# EAGLE design pwr_pos_lm317 (EAGLE 7.5.0)
Rusia Neagra MKII
TITLE: Rusia Neagra MKII

## Sheet 1 of 2: Rusia Neagra MKII power pcb
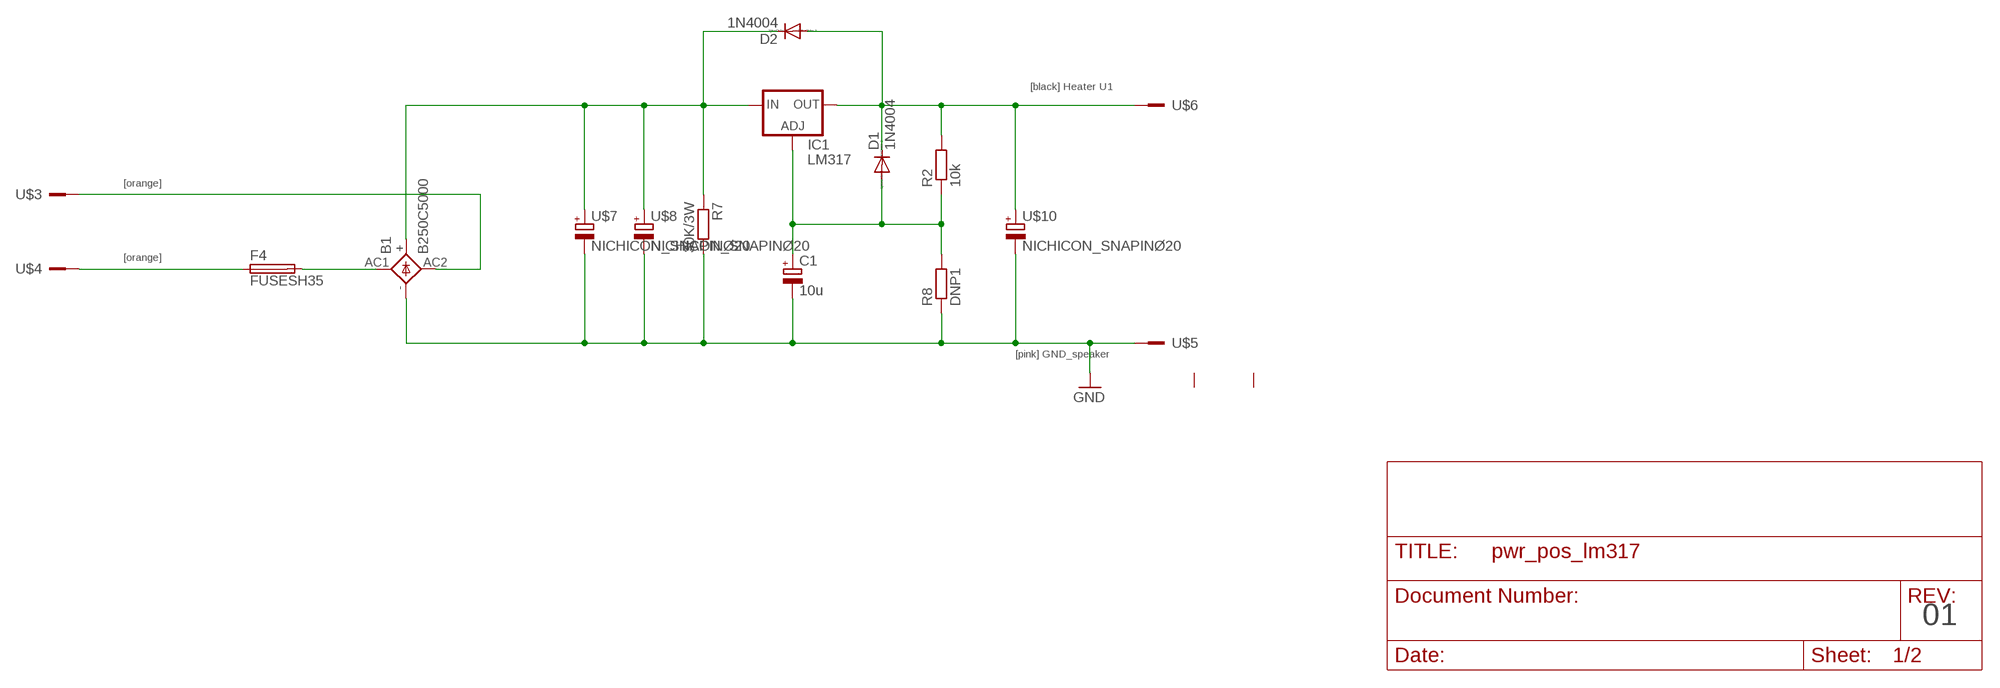
[diagram p0: schematic, sheet 1]

### Parts
B1  B250C5000  DIOTEC_BC5000  [DIOTEC_BC5000]
C1  10u  CPOL-EUE2,5-6E  [E2,5-6E]
D1  1N4004  [DO41-10]
D2  1N4004  [DO41-10]
F4  FUSESH35  [SH25]
IC1  LM317  LM317TS  [317TS]
R2  10k  R-EU_0411/12  [0411/12]
R7  30K/3W  R-EU_0922V  [0922V]
R8  DNP1  R-EU_0411/12  [0411/12]
U$1  SK456-60-3XM3L  [SK456-60-3XM3L]
U$2  RN_POWER  [RN]
U$3  M1  [M1_OFFSET]
U$4  M1  [M1_OFFSET]
U$5  M1  [M1_OFFSET]
U$6  M1  [M1_OFFSET]
U$7  NICHICON_SNAPINØ20  [C_20G10]
U$8  NICHICON_SNAPINØ20  [C_20G10]
U$10  NICHICON_SNAPINØ20  [C_20G10]

### Nets
30VAC_1: B1.AC2 U$3.1(KL)
30VAC_2: F4.1 U$4.1(KL)
GND: B1.- C1.- R7.2 R8.1 U$5.1(KL) U$7.- U$8.- U$10.-
N$2: B1.AC1 F4.2
N$3: C1.+ D1.A IC1.1(ADJ) R2.1 R8.2
N_C: B1.+ D2.C IC1.3(IN) R7.1 U$7.+ U$8.+
V+: D1.C D2.A IC1.2(OUT) R2.2 U$6.1(KL) U$10.+
Unconnected: U$1.P$1 U$1.P$2 U$2.SH@1 U$2.SH@2 U$2.SH@3 U$2.SH@4

### Notes on the sheet
- [black] Heater U1
- [orange]
- [orange]
- [pink] GND_speaker
- 01

## Sheet 2 of 2: Rusia Neagra MKII main point to point

## Library data of the parts
B1 = Simplex-DiscreteSemi:DIOTEC_BC5000: DIOTEC RECTIFIER B..C5000-3000A, B..C5000-3300A grid 1 x 10, 2 x 7,5 mm
C1 = rcl:CPOL-EU: POLARIZED CAPACITOR, European symbol
D1 D2 = diode:1N4004: DIODE general purpose rectifier, 1 A
F4 = fuse:FUSE: Fuse; OC_FARNELL: unknown; OC_NEWARK: unknown
IC1 = v-reg:LM317TS: VOLTAGE REGULATOR
R2 R7 R8 = rcl:R-EU_: RESISTOR, European symbol
U$1 = Simplex-Heatsinks:SK456-60-3XM3L: Fischer Elektronik SK456-60-3XM3L 2 pin heatsink 60x40, 40mm grid
U$2 = Simplex-Enclosures:RN_POWER: Rusia Neagra Amp power pcb
U$3-U$6 = Simplex-Connectors:M1: 1pin
U$7 U$8 U$10 = Simplex-rlc:NICHICON_SNAPIN: Nichicon snap-in capacitors

## Net classes
1 vcc: width 0.203 mm

## Board
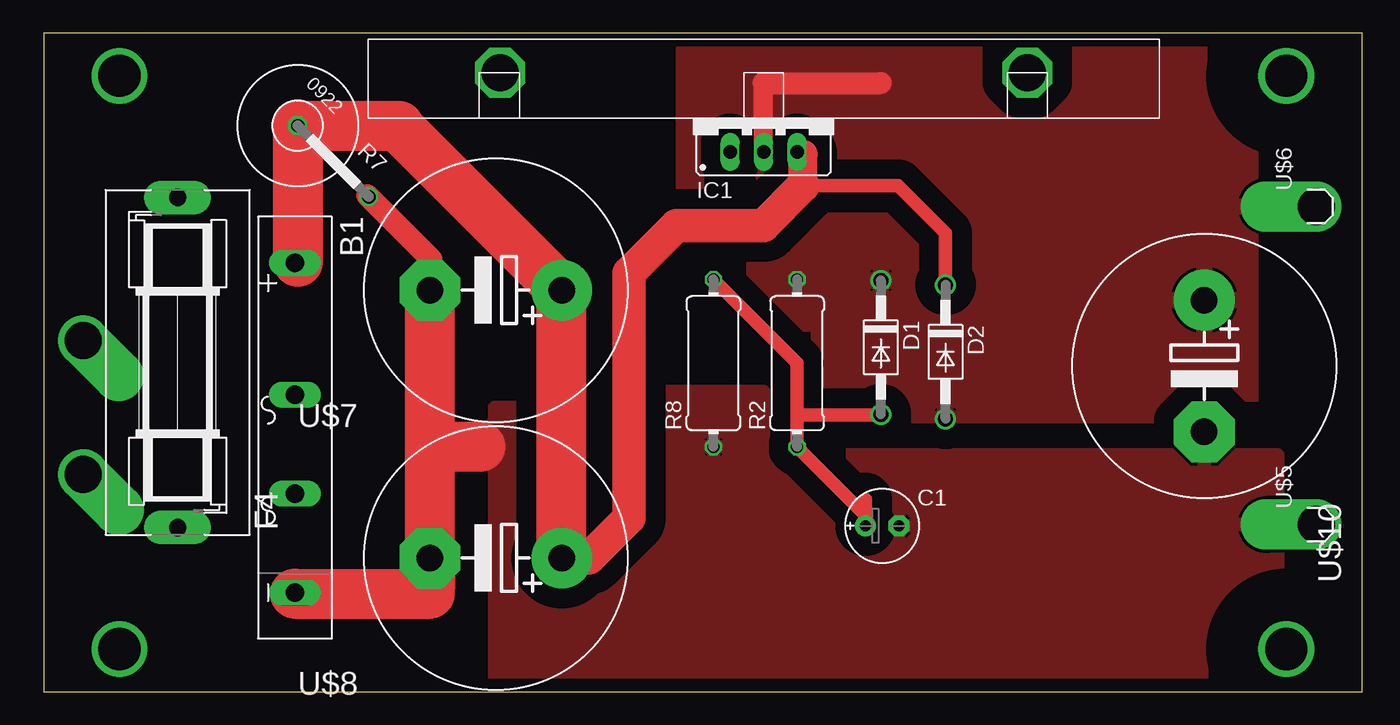
[diagram p1: board, top side]
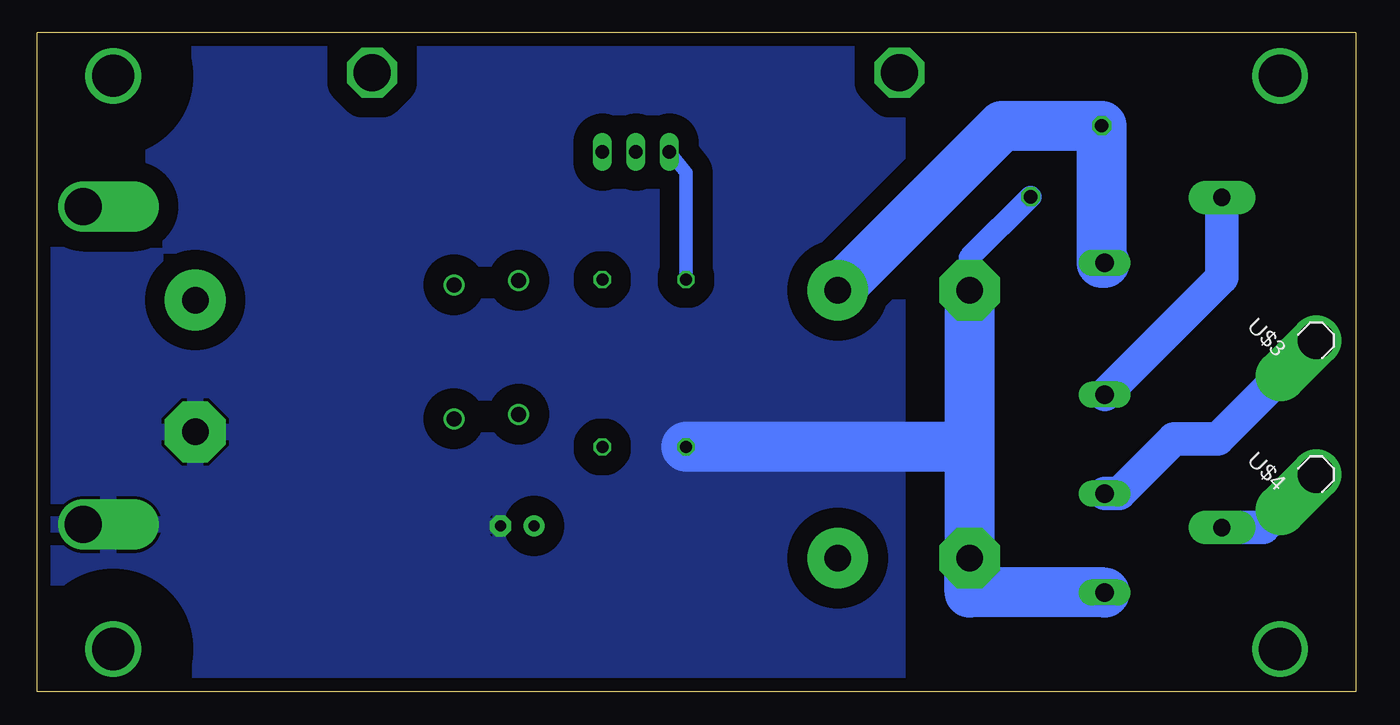
[diagram p2: board, bottom side, seen from below]

Size 100 x 50 mm. Coordinates in mm from the lower left corner, seen from the top.
Copper layers (1*16): Top 0.035mm / dielectric 1.5mm / Bottom 0.035mm
Design rules "default *": minimum track width 10mil, minimum drill 0.6mm, track to track 1.5mm, track to pad 1.5mm, pad to pad 1.5mm, via to via 1mm, smd to smd 1mm, copper to edge 40mil, drill to drill 8mil, minimum pad ring 0.2mm, minimum via ring 8mil, stop-mask expansion 4mil, vias tented up to drill 0mil, thermal gap 10mil

### Footprints (pad centres in the part's own frame; a part is rotated, then mirrored left to right if it is on the bottom)
DIOTEC_BC5000 = drill 1.397 long: + -13.5,0; - 11.5,0; AC1 -3.5,0; AC2 4,0
E2,5-6E = drill 0.813 pad 1.575: + -1.27,0 | drill 0.813 pad 1.575 octagon: - 1.27,0
DO41-10 = drill 1.118: A 5.08,0; C -5.08,0
SH25 = drill 1.321 pad 2.54 long: 1 -12.522,0; 2 12.522,0
317TS = drill 1.016 long: 1 -2.54,-2.54; 2 0,-2.54; 3 2.54,-2.54
0411/12 = drill 0.914 octagon: 1 -6.35,0; 2 6.35,0
0922V = drill 1.016 octagon: 1 -5.08,0; 2 2.54,0
SK456-60-3XM3L = drill 2.8 octagon: P$1 -20,0; P$2 20,0
RN = drill 3.2: SH@1 0,43.5; SH@2 88.5,43.5; SH@3 0,0; SH@4 88.5,0
M1_OFFSET = drill 2.8 pad 3.81 offset: 1 0,0
C_20G10 = drill 2.007 pad 4.597: + -5,0 | drill 2.007 pad 4.597 octagon: - 5,0

### Placement (x,y rotation side)
B1  19.05,19.05 270 top
C1  63.6,12.6 0 top
D1  63.5,26.14 270 top
D2  68.4,25.8 270 top
F4  10.16,25 90 top
IC1  54.6,43.5 0 top
R2  57.15,24.94 90 top
R7  22.86,39.37 315 top
R8  50.8,24.94 90 top
U$1  54.61,46.99 180 top
U$2  5.75,3.25 0 top
U$3  3,26.67 135 bottom
U$4  3,16.51 135 bottom
U$5  96.52,12.7 90 top
U$6  96.52,36.83 90 top
U$7  34.29,30.48 180 top
U$8  34.29,10.16 180 top
U$10  88.03,24.73 270 top

### Tracks (layer width: path | path; a pad name or v marks a point on that pad's centre or on a via)
30VAC_1
  Bottom 2.54: U$3.1 10.47,19.2 13.8,19.2 17.95,15.05 B1.AC2
30VAC_2
  Bottom 2.54: U$4.1 7.03,12.48 F4.1
GND
  Top 1.016: 19.05,7.45 B1.- 29,7.55 29.29,7.84 | 29.6,18.59 29.6,10.47 U$8.-
  Top 1.676: 29.17,33.06 R7.2 | R7.2 24.54,37.69 | R7.2 29.4,32.83 29.4,30
  Top 3.81: 19.05,7.45 29.29,7.45 | 29.29,10.32 U$7.- 29.29,30.64 | 29.29,9.85 29.29,7.84 | 33.11,18.59 29.6,18.59
  Bottom 1.676: R7.2 29.29,32.94 U$7.-
  Bottom 3.81: B1.- 29.29,7.55 U$8.- 29.29,18.59 | U$7.- 29.29,18.59 | 29.29,18.59 R8.1
  pour Bottom (isolate 1.016): 34.78,49.53 99.92,49.53 99.92,0.34 34.78,0.34
  pour Top (isolate 1.016): 34.2,21.6 34.2,0 93.6,0 93.6,18 55.2,18 54.6,22.8 36.6,22.8 36.6,21.6
N$2
  Bottom 2.54: F4.2 10.16,31.44 B1.AC1
N$3
  Top 1.016: 57.15,21 R2.1 62.33,13.41 | 57.15,21 57.15,24.94 R8.2 | 62.33,14.61 62.33,13.41 | 62.33,13.41 C1.+ | D1.A 63.44,21 57.15,21
  Bottom 1.016: IC1.1 50.8,39.4 R8.2
N_C
  Top 1.016: 57.6,40.8 57.46,40.66 IC1.3 | 57.6,38.4 64.8,38.4 68.4,34.8 D2.C | 19.27,43.05 19.27,32.77 B1.+
  Top 1.676: 26.88,42.89 26.81,42.96 19.39,42.96
  Top 2.184: 57.6,38.4 57.6,40.8
  Top 2.54: 57.6,38.4 54.6,35.4 48,35.4 44.4,31.8 44.4,13.2 41.36,10.16 U$8.+
  Top 3.81: U$8.+ U$7.+ | 19.27,43.05 19.27,32.64 | 19.39,42.96 26.93,42.96 | 26.88,42.89 U$7.+ | U$7.+ 39.36,30.41
  Bottom 3.81: B1.+ 19.27,32.55 R7.1 26.81,42.96 U$7.+
V+
  Top 1.422: IC1.2 54.6,46.2
  Top 1.676: 54.6,46.2 63.5,46.2
  pour Top (isolate 1.016): 48.58,49.53 48.58,27.94 58.8,27.94 58.8,21 91.52,21 91.52,49.53

### Text on the board
tDocu: V+ | ~ | ~ | GND | lm317 positive supply
bDocu: V+ | ~ | ~ | GND | lm317 positive supply